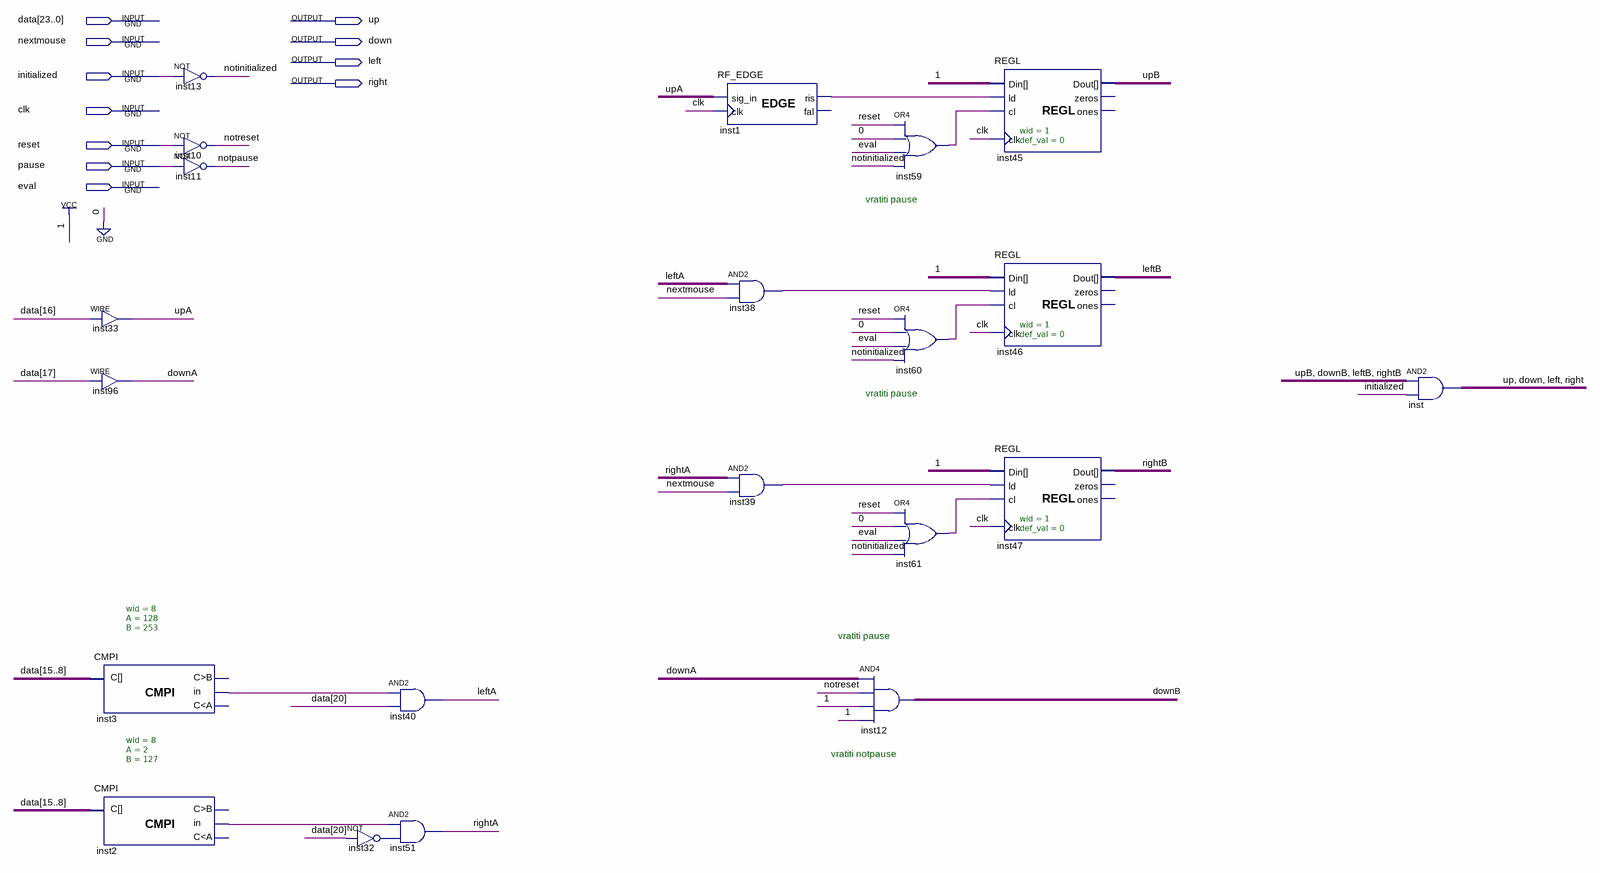
[diagram p0: schematic sheet]
// Quartus schematic mouse.bdf as structural Verilog: 21 symbols, 11 pins
module mouse (
  input  [23:0] data,
  input  nextmouse,
  input  initialized,
  input  clk,
  input  reset,
  input  pause,
  input  eval,
  output up,
  output down,
  output left,
  output right
);

  wire downA, downB, inst1_ris, inst2_isin, inst3_isin, inst32_out, inst38_out, inst39_out, inst59_out,
       inst60_out, inst61_out, leftA, leftB, notinitialized, notpause, notreset, rightA, rightB, upA, upB;

  assign upA = data[16];  // WIRE inst33
  assign downA = data[17];  // WIRE inst96
  CMPI #(.wid(8), .A(128), .B(253)) inst3 (.C(data[15:8]), .isin(inst3_isin));  // open: gr, ls
  CMPI #(.wid(8), .A(2), .B(127)) inst2 (.C(data[15:8]), .isin(inst2_isin));  // open: gr, ls
  not inst13 (notinitialized, initialized);
  not inst10 (notreset, reset);
  not inst11 (notpause, pause);
  and inst40 (leftA, inst3_isin, data[20]);
  and inst51 (rightA, inst2_isin, inst32_out);
  not inst32 (inst32_out, data[20]);
  RF_EDGE inst1 (.sig_in(upA), .clk(clk), .ris(inst1_ris));  // open: fal
  and inst38 (inst38_out, leftA, nextmouse);
  and inst39 (inst39_out, rightA, nextmouse);
  or inst59 (inst59_out, reset, 1'b0, eval, notinitialized);
  or inst60 (inst60_out, reset, 1'b0, eval, notinitialized);
  or inst61 (inst61_out, reset, 1'b0, eval, notinitialized);
  and inst12 (downB, downA, notreset, 1'b1, 1'b1);
  REGL #(.wid(1), .def_val(0)) inst45 (
    .Din(1'b1), .ld(inst1_ris), .cl(inst59_out), .clk(clk), .Dout(upB));  // open: zeros, ones
  REGL #(.wid(1), .def_val(0)) inst46 (
    .Din(1'b1), .ld(inst38_out), .cl(inst60_out), .clk(clk), .Dout(leftB));  // open: zeros, ones
  REGL #(.wid(1), .def_val(0)) inst47 (
    .Din(1'b1), .ld(inst39_out), .cl(inst61_out), .clk(clk), .Dout(rightB));  // open: zeros, ones
  assign {up, down, left, right} = {upB, downB, leftB, rightB} & {4{initialized}};  // AND2 inst, 4 bits wide

  // Notes on the sheet:
  //   vratiti pause
  //   vratiti pause
  //   vratiti pause
  //   vratiti notpause
endmodule
